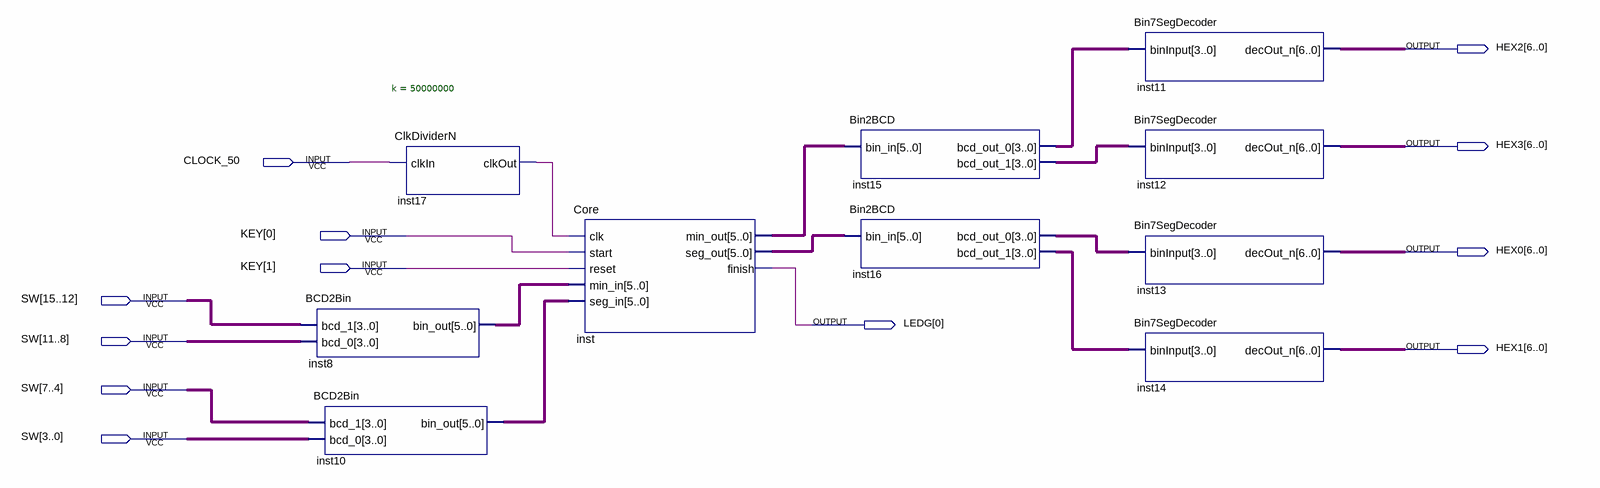
[diagram p0: schematic sheet]
// Quartus schematic mp_esq.bdf as structural Verilog: 10 symbols, 12 pins
module mp_esq (
  input  CLOCK_50,
  input  [1:0] KEY,
  input  [15:0] SW,
  output [6:0] HEX2,
  output [6:0] HEX3,
  output [6:0] HEX0,
  output [0:0] LEDG,
  output [6:0] HEX1
);

  wire inst17_clkout;
  wire [3:0] inst15_bcd_out_0, inst15_bcd_out_1, inst16_bcd_out_0, inst16_bcd_out_1;
  wire [5:0] inst8_bin_out, inst10_bin_out, inst_min_out, inst_seg_out;

  BCD2Bin inst8 (.bcd_1(SW[15:12]), .bcd_0(SW[11:8]), .bin_out(inst8_bin_out));
  BCD2Bin inst10 (.bcd_1(SW[7:4]), .bcd_0(SW[3:0]), .bin_out(inst10_bin_out));
  ClkDividerN #(.k(50000000)) inst17 (.clkIn(CLOCK_50), .clkOut(inst17_clkout));
  Core inst (
    .clk(inst17_clkout), .start(KEY[0]), .reset(KEY[1]), .min_in(inst8_bin_out), .seg_in(inst10_bin_out),
    .min_out(inst_min_out), .seg_out(inst_seg_out), .finish(LEDG[0]));
  Bin2BCD inst15 (.bin_in(inst_min_out), .bcd_out_0(inst15_bcd_out_0), .bcd_out_1(inst15_bcd_out_1));
  Bin2BCD inst16 (.bin_in(inst_seg_out), .bcd_out_0(inst16_bcd_out_0), .bcd_out_1(inst16_bcd_out_1));
  Bin7SegDecoder inst11 (.binInput(inst15_bcd_out_0), .decOut_n(HEX2));
  Bin7SegDecoder inst12 (.binInput(inst15_bcd_out_1), .decOut_n(HEX3));
  Bin7SegDecoder inst13 (.binInput(inst16_bcd_out_0), .decOut_n(HEX0));
  Bin7SegDecoder inst14 (.binInput(inst16_bcd_out_1), .decOut_n(HEX1));
endmodule
